# Altium schematic sheet DAC.SchDoc
size 279 x 215 mm; SheetNumber: 4; SheetTotal: 6; SPICEModelCacheRUGZJIPY: <root> / <DocumentId>RUGZJIPY</DocumentId> / <CacheFrame Number="0"> / <Model Name="cap" Kind="MDL"> / <Text>*Default semiconductor capacitor / .MODEL CAP C()</Text> / </Model> / </CacheFrame> / </root>
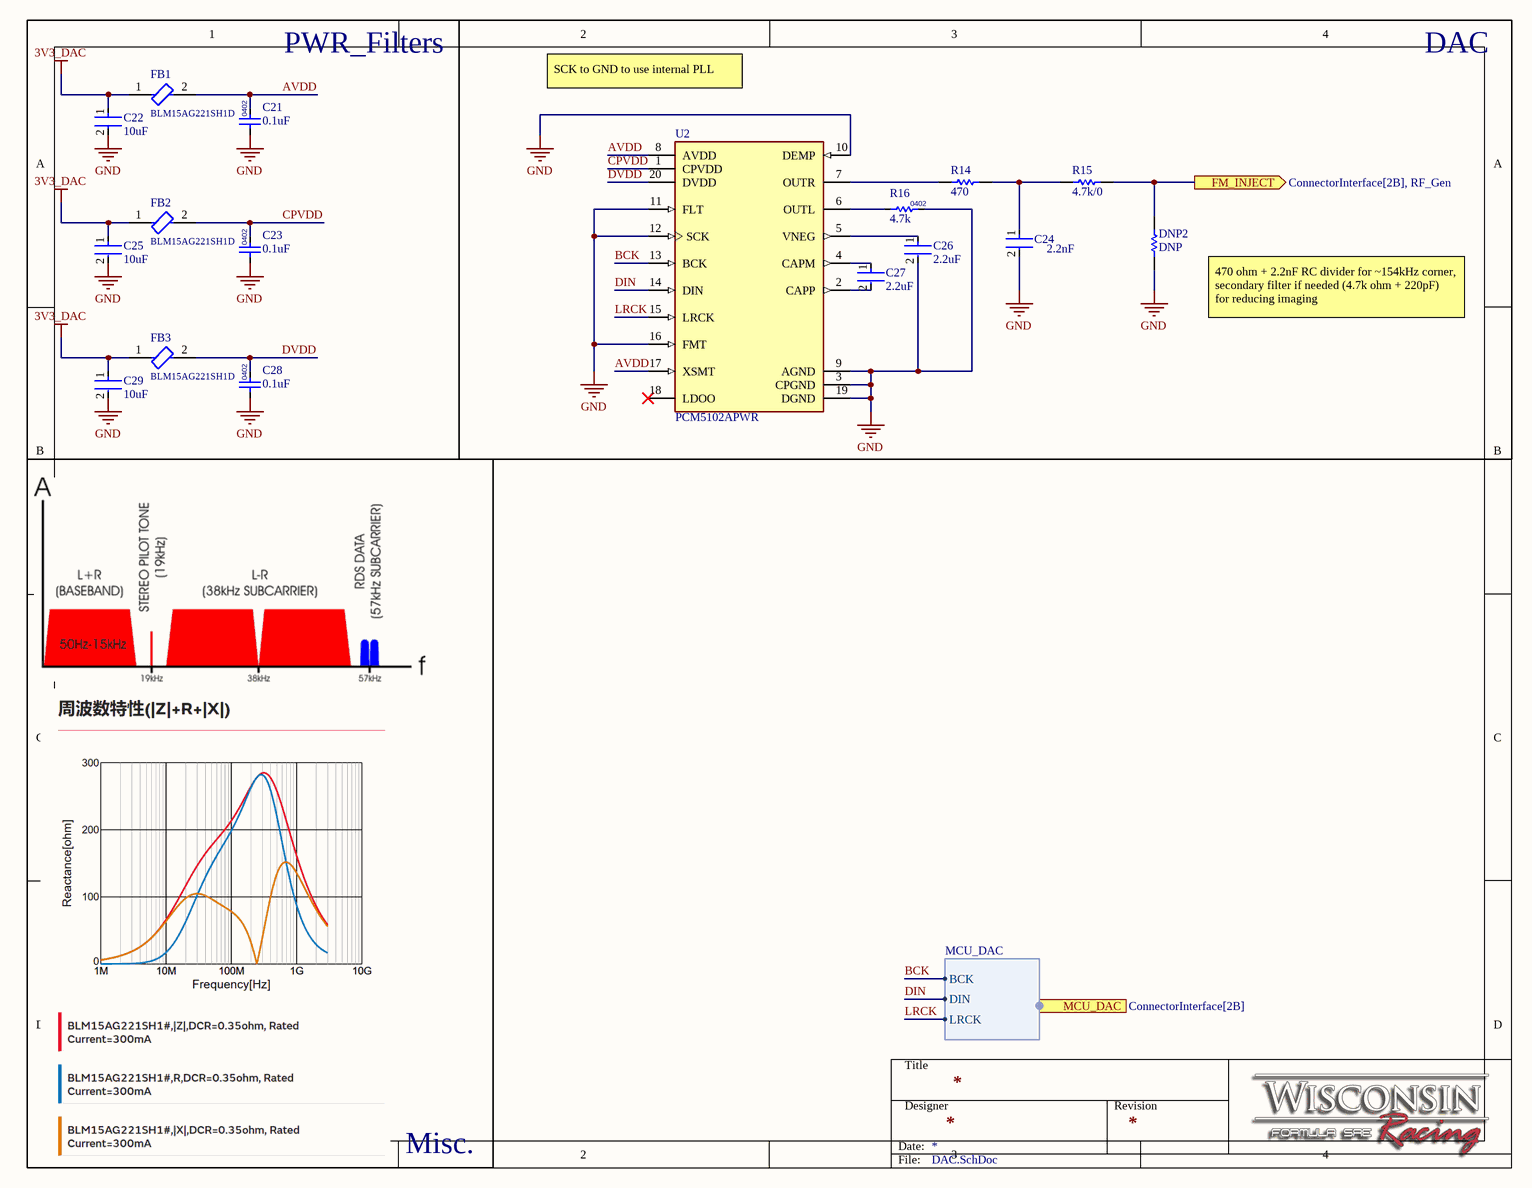
[diagram p0: DAC.SchDoc]

## Parts
C21  0.1uF  [FP-CC0402-IPC_B]
C22  10uF  [FP-C0402C106M9PACTU-MFG]
C23  0.1uF  [FP-CC0402-IPC_B]
C24  2.2nF  [FP-GRM155-0_05-IPC_C]
C25  10uF  [FP-C0402C106M9PACTU-MFG]
C26  2.2uF  [FP-GRM155-0_2-IPC_B]
C27  2.2uF  [FP-GRM155-0_2-IPC_B]
C28  0.1uF  [FP-CC0402-IPC_B]
C29  10uF  [FP-C0402C106M9PACTU-MFG]
DNP2  DNP  [RESC1005X40X25NL05T10]
FB1  BLM15AG221SH1D  [FP-BLM15-0_05-MFG]
FB2  BLM15AG221SH1D  [FP-BLM15-0_05-MFG]
FB3  BLM15AG221SH1D  [FP-BLM15-0_05-MFG]
R14  470  [RESC1005X40X25ML05T10]
R15  4.7k/0  [RESC1005X40X25NL05T10]
R16  value 4.7k  [RESC1005X40X25NL05T10]  (hidden comment: 4.7k 1%)
U2  PCM5102APWR  [FP-PW0020A-IPC_A]

## Blocks framed on the sheet
PWR_Filters: C21-C23 C25 C28 C29 FB1-FB3
DAC: C24 C26 C27 DNP2 R14-R16 U2

## Ports
FM_INJECT (out, see ConnectorInterface[2B], RF_Gen), MCU_DAC (harness MCU_DAC, see ConnectorInterface[2B])

## Harnesses
MCU_DAC: BCK, DIN, LRCK

## Nets
3V3_DAC: C22.1 C25.1 C29.1 FB1.1 FB2.1 FB3.1
GND: C21.1 C22.2 C23.1 C24.2 C25.2 C26.2 C28.1 C29.2 DNP2.1 R16.2 U2.3(CPGND) U2.9(AGND) U2.10(DEMP) U2.11(FLT) U2.12(SCK) U2.16(FMT) U2.19(DGND)
AVDD: C21.2 FB1.2 U2.8(AVDD) U2.17(XSMT)
BCK: U2.13(BCK) ; port MCU_DAC.BCK
CPVDD: C23.2 FB2.2 U2.1(CPVDD)
DIN: U2.14(DIN) ; port MCU_DAC.DIN
DVDD: C28.2 FB3.2 U2.20(DVDD)
FM_INJECT: DNP2.2 R15.2 ; port FM_INJECT
LRCK: U2.15(LRCK) ; port MCU_DAC.LRCK
NetC24_1: C24.1 R14.2 R15.1
NetC26_1: C26.1 U2.5(VNEG)
NetC27_1: C27.1 U2.4(CAPM)
NetC27_2: C27.2 U2.2(CAPP)
NetR14_1: R14.1 U2.7(OUTR)
NetR16_1: R16.1 U2.6(OUTL)

Not connected (* = marked no-connect by the designer): U2 18(LDOO)*

## Notes on the sheet
- SCK to GND to use internal PLL
- 470 ohm + 2.2nF RC divider for ~154kHz corner, secondary filter if needed (4.7k ohm + 220pF)  for reducing imaging
- Misc.
- Title
- Designer
- Revision
- Date:
- File:
- (in symbol CMP-Cap-00006-1) 0402

## Library data of the parts
C21 C23 C28 = CMP-Cap-00006-1: Ceramic Capacitor, Multilayer, Ceramic, 16V, 10% +Tol, 10% -Tol, X7R, 15% TC, 0.1uF, Surface Mount, 0402; Dielectric: XR7; Capacitance: 100nF; Tolerance: 10%; Voltage Rating: 16V
C22 C25 C29 = CMP-03020-034678-1: CAP CER 10UF 6.3V X5R 0402; Tolerance: 20%; Dielectric Material: Ceramic; Voltage Rating: 6.3V; Thickness: 0.028inch; REACH SVHC: No SVHC; RoHS Compliant: Yes; Case Code (Metric): 1005; Lead Free: Lead Free; Length: 0.039inch; Max Operating Temperature: 85°C; Capacitance: 10uF; Voltage Rating (DC): 6.3V; Min Operating Temperature: -55°C; Case/Package: 0402; Mount: Surface Mount; Case Code (Imperial): 0402; Dielectric: X5R; Packaging: Cut Tape; Width: 0.02inch
C24 = CMP-06035-062041-1: Chip Multilayer Ceramic Capacitors for General Purpose, 0402, 2200pF, C0G, 30ppm/°C, 5%, 50V
C26 C27 = CMP-06035-003072-1: Chip Multilayer Ceramic Capacitors for General Purpose, 0402, 2.2uF, X7R, 15%, 10%, 10V; Case/Package: 0402
DNP2 R15 = CMP-1011-00001-2: Manufacturer: Yageo / Phycomp; Part Number: RC0402JR-070RL
FB1-FB3 = CMP-06046-002173-1: Chip Ferrite Bead, 0402, 220Ω @ 100MHz, 0.35Ω, 25%, 300mA; Impedance: 220R; Number of Lines: 1; DC Resistance (DCR): 350mR; Package Quantity: 10000; Max Operating Temperature: 125°C; Case Code (Imperial): 0402; Ratings: AEC-Q200; Packaging: Tape and Reel; Width: 0.5mm; Core Material: Ferrite; Length: 0.039inch; Max Current Rating: 300mA; REACH SVHC: No SVHC; Weight: 2.3E-05oz; Height: 0.022inch; Max DC Current: 300mA; Series: EMIFIL®, BLM15A_SH; Test Frequency: 100MHz; Min Operating Temperature: -55°C; Termination: SMD/SMT; Mount: Surface Mount; Case Code (Metric): 1005; Depth: 0.55mm; Case/Package: 0402; RoHS Compliant: Yes; Tolerance: 25%; Number of Circuits: 1
R14 = CMP-2002-07697-1: Part Number: RC0402FR-07470RL; Manufacturer: Yageo / Phycomp
R16 = CMP-00178-1: Res General Purpose Thick Film 0402 4.7K Ohm 1% 1/16W ±100ppm/°C Molded SMD Paper T/R; Power Rating: 63mW; Voltage Rating (AC): 50V; Power Dissipation: 62.5mW; REACH SVHC: Yes; Harmonized Tariff Schedule (HTS) Code: 8533.21.00.30; Composition: Thick Film; Max Operating Temperature: 155°C; Number of Terminals: 2; Min Operating Temperature: -55°C; Depth: 500µm; Introduction Date: 2008-07-18; Case Code (Metric): 1005; Pins: 2; Packaging: Tape & Reel; Height: 350µm; China RoHS: Non-Compliant; Lead Free: Lead Free; Termination: SMD/SMT; Tolerance: 1%; Schedule B: 8533210045, 8533210045; Length: 1mm; Lifecycle Status: Production; Case Code (Imperial): 0402; RoHS: Compliant; Width: 500µm; Mounting Technology: Surface Mount; Temperature Coefficient: 100ppm/°C; Export Control Classification Number (ECCN) Code: EAR99; Country of Origin: Mainland China, Taiwan; Working Voltage: 50V; Voltage Rating: 50V; Case/Package: 0402; Voltage Rating (DC): 50V; Military Standard: Not
U2 = CMP-04861-000013-1: IC DAC 16/24/32BIT 384K 20TSSOP; Power Consumption: 59.4mW; Number of Analog Inputs: 0; Supply Type: Analog; Resolution: 32b; Number of Analog Outputs: 2; Max Power Dissipation: 187mW; Sampling Rate: 384KS/s; Operating Supply Voltage: 3.3V; Number of Bits: 32; Max Supply Voltage: 3.6V; Interface: Serial; Polarity: Unipolar; Min Supply Voltage: 3V; Output Type: Voltage; Signal to Noise Ratio (SNR): 112dB; Contact Plating: Gold; Package Quantity: 2000; Number of Pins: 20; Max Operating Temperature: 85°C; Series: DirectPath™; Case/Package: TSSOP; Conversion Rate: 384KS/s; Number of DAC Channels: 2; Mount: Surface Mount; REACH SVHC: No SVHC; Packaging: Tape and Reel; Number of Converters: 2; Min Operating Temperature: -25°C; Lead Free: Lead Free